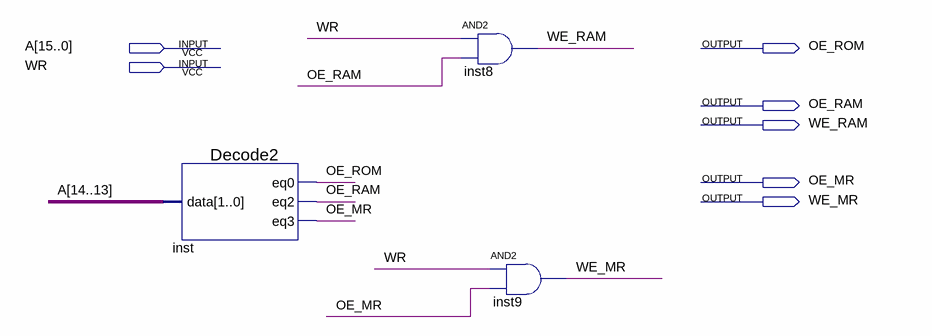
[diagram p0: schematic sheet]
// Quartus schematic MemDec.bdf as structural Verilog: 3 symbols, 7 pins
module MemDec (
  input  [15:0] A,
  input  WR,
  output OE_ROM,
  output OE_RAM,
  output WE_RAM,
  output OE_MR,
  output WE_MR
);

  Decode2 inst (.data(A[14:13]), .eq0(OE_ROM), .eq2(OE_RAM), .eq3(OE_MR));
  and inst8 (WE_RAM, WR, OE_RAM);
  and inst9 (WE_MR, WR, OE_MR);
endmodule
